# EAGLE design plc_esp32 (EAGLE 9.6.2)
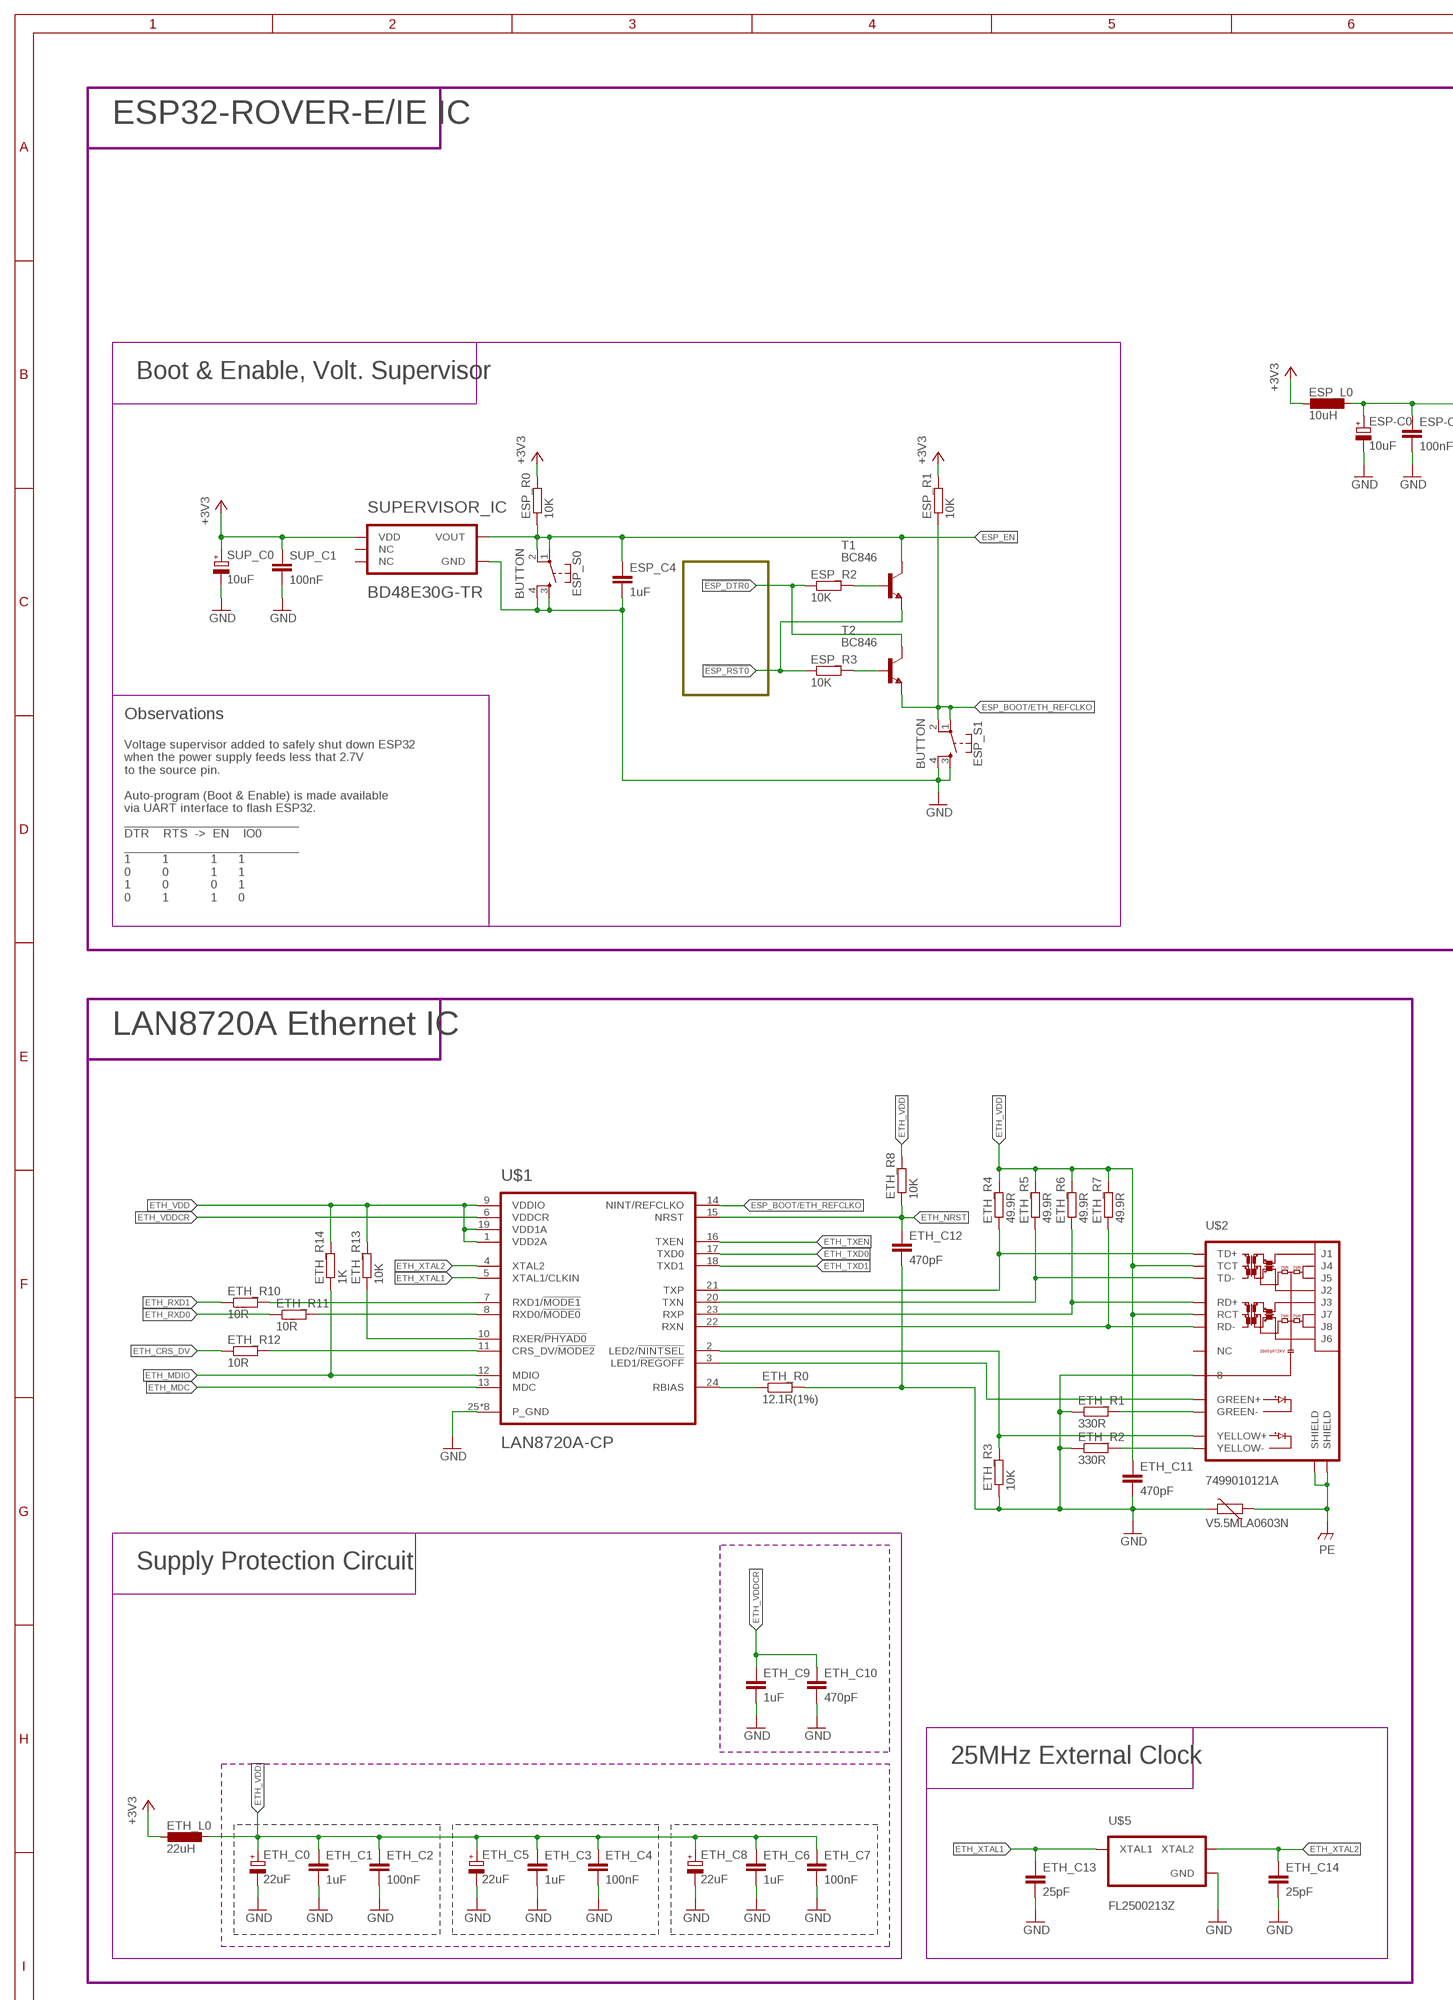
[diagram p0: schematic, sheet 1, part 1 of 2]
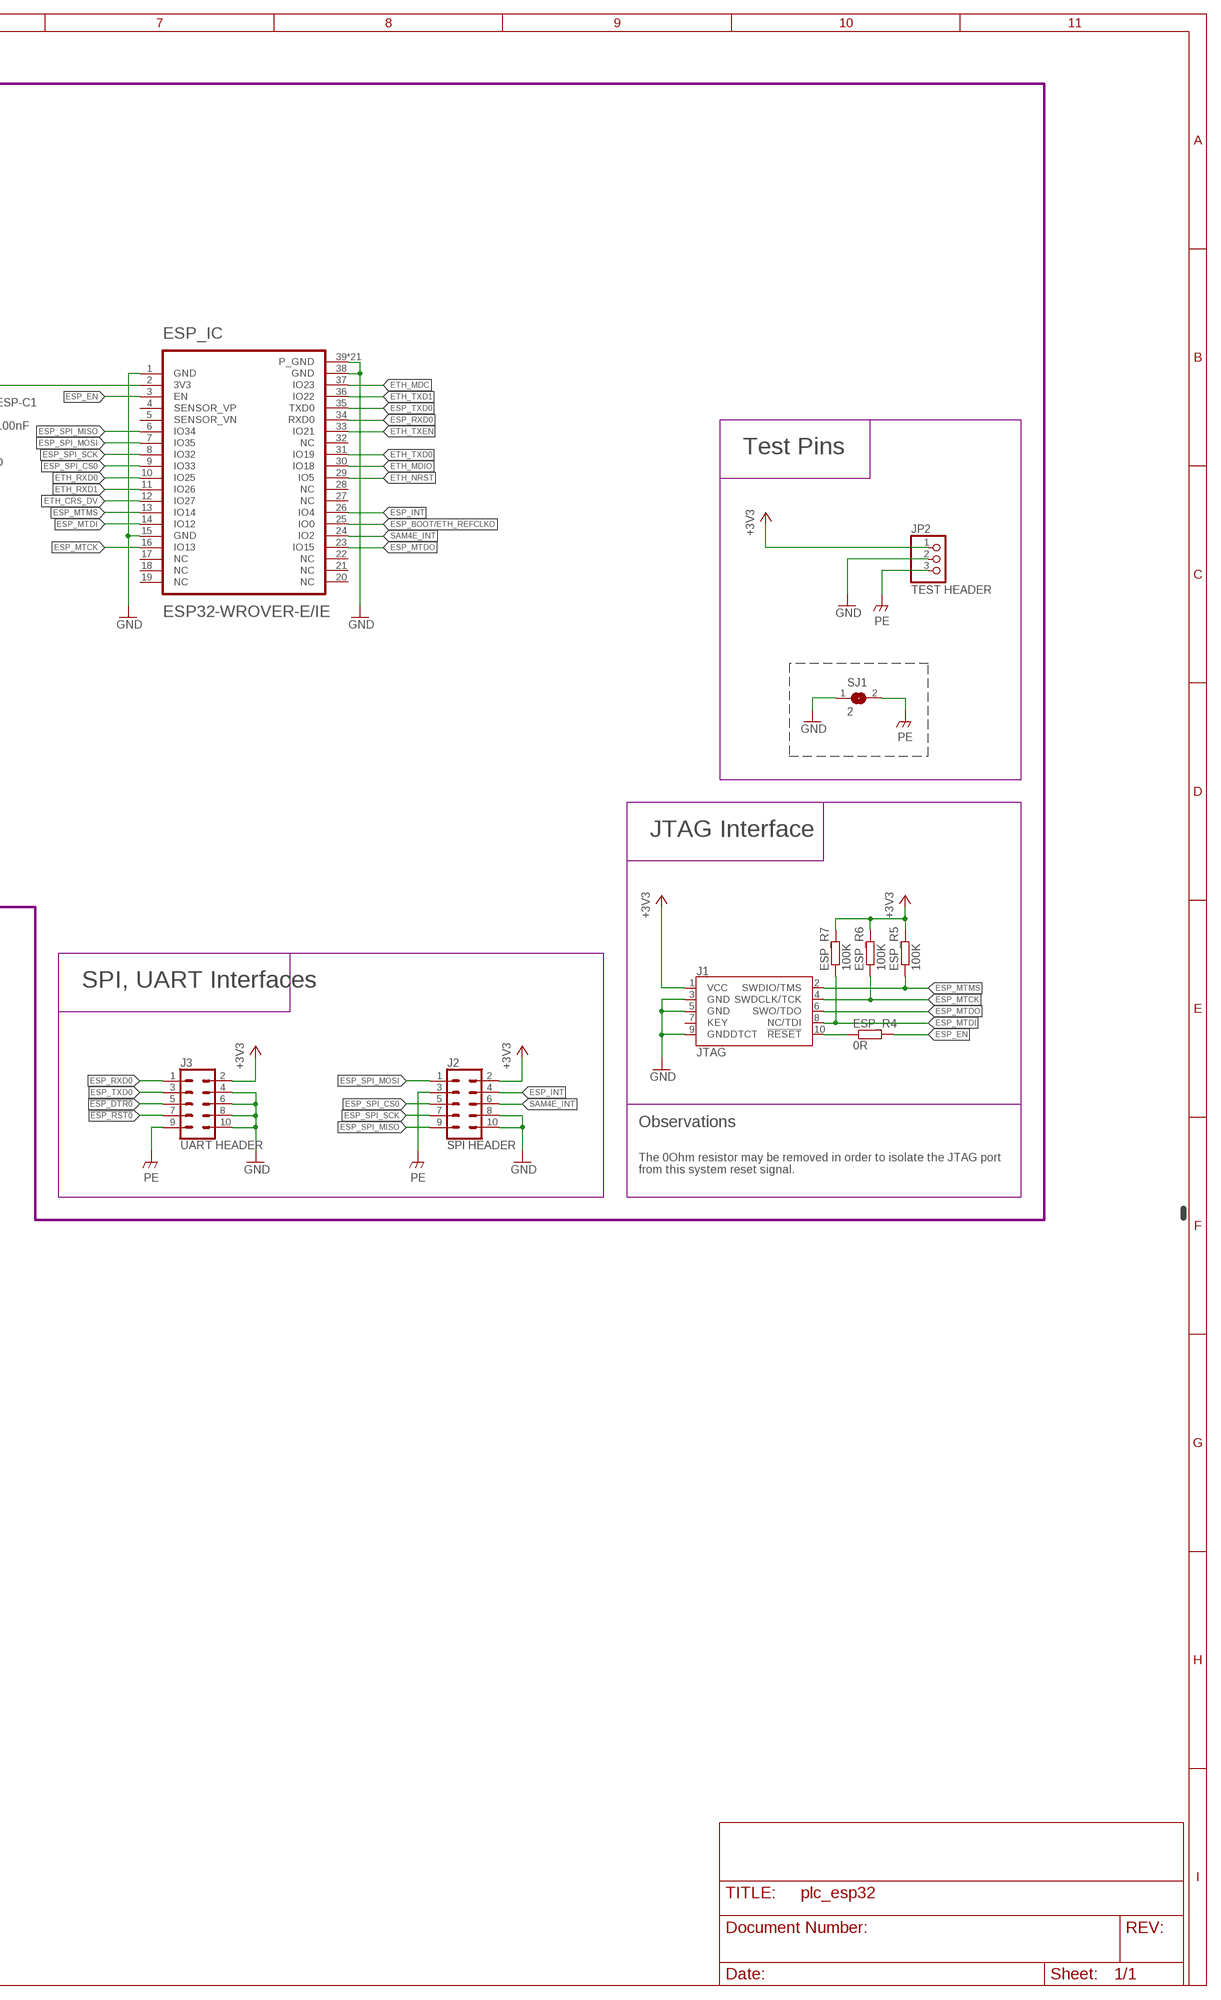
[diagram p1: schematic, sheet 1, part 2 of 2]

## Parts
ESP-C0  10uF  CPOL-EUSMCB  [SMC_B]
ESP-C1  100nF  C-EUC0402  [C0402]
ESP_C4  1uF  C-EUC0402  [C0402]
ESP_IC  ESP32-WROVER-E/IE  [ESP32-WROVER-E/IE]
ESP_L0  10uH  L-EUL1812  [L1812]
ESP_R0  10K  R-EU_R0402  [R0402]
ESP_R1  10K  R-EU_R0402  [R0402]
ESP_R2  10K  R-EU_R0402  [R0402]
ESP_R3  10K  R-EU_R0402  [R0402]
ESP_R4  0R  R-EU_R0402  [R0402]
ESP_R5  100K  R-EU_R0402  [R0402]
ESP_R6  100K  R-EU_R0402  [R0402]
ESP_R7  100K  R-EU_R0402  [R0402]
ESP_S0  BUTTON  MOMENTARY-SWITCH-SPST-2-SMD-4.6X2.8MM  [TACTILE_SWITCH_SMD_4.6X2.8MM]
ESP_S1  BUTTON  MOMENTARY-SWITCH-SPST-2-SMD-4.6X2.8MM  [TACTILE_SWITCH_SMD_4.6X2.8MM]
ETH_C0  22uF  CPOL-EUSMCB  [SMC_B]
ETH_C1  1uF  C-EUC0402  [C0402]
ETH_C2  100nF  C-EUC0402  [C0402]
ETH_C3  1uF  C-EUC0402  [C0402]
ETH_C4  100nF  C-EUC0402  [C0402]
ETH_C5  22uF  CPOL-EUSMCB  [SMC_B]
ETH_C6  1uF  C-EUC0402  [C0402]
ETH_C7  100nF  C-EUC0402  [C0402]
ETH_C8  22uF  CPOL-EUSMCB  [SMC_B]
ETH_C9  1uF  C-EUC0402  [C0402]
ETH_C10  470pF  C-EUC0402  [C0402]
ETH_C11  470pF  C-EUC0402  [C0402]
ETH_C12  470pF  C-EUC0402  [C0402]
ETH_C13  25pF  C-EUC0402  [C0402]
ETH_C14  25pF  C-EUC0402  [C0402]
ETH_L0  22uH  L-EUL1812  [L1812]
ETH_R0  12.1R(1%)  R-EU_R0402  [R0402]
ETH_R1  330R  R-EU_R0402  [R0402]
ETH_R2  330R  R-EU_R0402  [R0402]
ETH_R3  10K  R-EU_R0402  [R0402]
ETH_R4  49.9R  R-EU_R0402  [R0402]
ETH_R5  49.9R  R-EU_R0402  [R0402]
ETH_R6  49.9R  R-EU_R0402  [R0402]
ETH_R7  49.9R  R-EU_R0402  [R0402]
ETH_R8  10K  R-EU_R0402  [R0402]
ETH_R10  10R  R-EU_R0402  [R0402]
ETH_R11  10R  R-EU_R0402  [R0402]
ETH_R12  10R  R-EU_R0402  [R0402]
ETH_R13  10K  R-EU_R0402  [R0402]
ETH_R14  1K  R-EU_R0402  [R0402]
J1  JTAG  CORTEX_JTAG_DEBUG_SMD  [2X5-SMD-1.27MM]
J2  SPI HEADER  CONN_05X2SHD_SMD  [2X5-SHROUDED_SMD]
J3  UART HEADER  CONN_05X2SHD_SMD  [2X5-SHROUDED_SMD]
JP2  TEST HEADER  PINHD-1X3  [1X03]
MCU_VAR1  V5.5MLA0603N  VARISTORCN0603  [CT/CN0603]
SJ1  2  SJ  [SJ]
SUP_C0  10uF  CPOL-EUSMCB  [SMC_B]
SUP_C1  100nF  C-EUC0402  [C0402]
SUPERVISOR_IC  BD48E30G-TR  [SSOP5]
T1  BC846  [SOT23]
T2  BC846  [SOT23]
U$1  LAN8720A-CP  [QFN-24(4X4MM)]
U$2  7499010121A  [RJ45-7499010121A]
U$5  FL2500213Z  [3.2X2.5MM]

## Nets
!ESP_DTR0: ESP_R2.1 J3.5 T2.3(C)
!ESP_RST0: ESP_R3.1 J3.7 T1.2(E)
+3V3: ESP_L0.2 ESP_R0.2 ESP_R1.2 ESP_R5.2 ESP_R6.2 ESP_R7.2 ETH_L0.2 J1.1(VCC) J2.2 J3.2 JP2.1 SUP_C0.+ SUP_C1.1 SUPERVISOR_IC.2(VDD)
ESP_3V3: ESP-C0.+ ESP-C1.1 ESP_IC.2(3V3) ESP_L0.1
ESP_BOOT/ETH_REFCLKO: ESP_IC.25(IO0) ESP_R1.1 ESP_S1.1 ESP_S1.2 T2.2(E) U$1.14(NINT/REFCLKO)
ESP_EN: ESP_C4.1 ESP_IC.3(EN) ESP_R0.1 ESP_R4.2 ESP_S0.1 ESP_S0.2 SUPERVISOR_IC.1(VOUT) T1.3(C)
ESP_INT: ESP_IC.26(IO4) J2.4
ESP_MTCK: ESP_IC.16(IO13) ESP_R6.1 J1.4(SWDCLK/TCK)
ESP_MTDI: ESP_IC.14(IO12) ESP_R7.1 J1.8(NC/TDI)
ESP_MTDO: ESP_IC.23(IO15) J1.6(SWO/TDO)
ESP_MTMS: ESP_IC.13(IO14) ESP_R5.1 J1.2(SWDIO/TMS)
ESP_RXD0: ESP_IC.34(RXD0) J3.1
ESP_SPI_CS0: ESP_IC.9(IO33) J2.5
ESP_SPI_MISO: ESP_IC.6(IO34) J2.9
ESP_SPI_MOSI: ESP_IC.7(IO35) J2.1
ESP_SPI_SCK: ESP_IC.8(IO32) J2.7
ESP_TXD0: ESP_IC.35(TXD0) J3.3
ETH_CRS_DV: ESP_IC.12(IO27) ETH_R12.1
ETH_MDC: ESP_IC.37(IO23) U$1.13(MDC)
ETH_MDIO: ESP_IC.30(IO18) ETH_R14.1 U$1.12(MDIO)
ETH_NRST: ESP_IC.29(IO5) ETH_C12.1 ETH_R8.1 U$1.15(NRST)
ETH_RJ45_LED2: ETH_R3.2 U$1.2(LED2/!NINTSEL) U$2.12(YELLOW+)
ETH_RJ45_RXN: ETH_R7.1 U$1.22(RXN) U$2.6(RD-)
ETH_RJ45_RXP: ETH_R6.1 U$1.23(RXP) U$2.4(RD+)
ETH_RJ45_TXN: ETH_R5.1 U$1.20(TXN) U$2.3(TD-)
ETH_RJ45_TXP: ETH_R4.1 U$1.21(TXP) U$2.1(TD+)
ETH_RXD0: ESP_IC.10(IO25) ETH_R11.1
ETH_RXD1: ESP_IC.11(IO26) ETH_R10.1
ETH_TXD0: ESP_IC.31(IO19) U$1.17(TXD0)
ETH_TXD1: ESP_IC.36(IO22) U$1.18(TXD1)
ETH_TXEN: ESP_IC.33(IO21) U$1.16(TXEN)
ETH_VDD: ETH_C0.+ ETH_C1.1 ETH_C2.1 ETH_C3.1 ETH_C4.1 ETH_C5.+ ETH_C6.1 ETH_C7.1 ETH_C8.+ ETH_C11.1 ETH_L0.1 ETH_R4.2 ETH_R5.2 ETH_R6.2 ETH_R7.2 ETH_R8.2 ETH_R13.2 ETH_R14.2 U$1.1(VDD2A) U$1.9(VDDIO) U$1.19(VDD1A) U$2.2(TCT) U$2.5(RCT)
ETH_VDDCR: ETH_C9.1 ETH_C10.1 U$1.6(VDDCR)
ETH_XTAL1: ETH_C13.1 U$1.5(XTAL1/CLKIN) U$5.1(XTAL1)
ETH_XTAL2: ETH_C14.1 U$1.4(XTAL2) U$5.3(XTAL2)
GND: ESP-C0.- ESP-C1.2 ESP_C4.2 ESP_IC.1(GND) ESP_IC.15(GND) ESP_IC.38(GND) ESP_IC.39(P_GND) ESP_IC.40(P_GND) ESP_IC.41(P_GND) ESP_IC.42(P_GND) ESP_IC.43(P_GND) ESP_IC.44(P_GND) ESP_IC.45(P_GND) ESP_IC.46(P_GND) ESP_IC.47(P_GND) ESP_IC.48(P_GND) ESP_IC.49(P_GND) ESP_IC.50(P_GND) ESP_IC.51(P_GND) ESP_IC.52(P_GND) ESP_IC.53(P_GND) ESP_IC.54(P_GND) ESP_IC.55(P_GND) ESP_IC.56(P_GND) ESP_IC.57(P_GND) ESP_IC.58(P_GND) ESP_IC.59(P_GND) ESP_S0.3 ESP_S0.4 ESP_S1.3 ESP_S1.4 ETH_C0.- ETH_C1.2 ETH_C2.2 ETH_C3.2 ETH_C4.2 ETH_C5.- ETH_C6.2 ETH_C7.2 ETH_C8.- ETH_C9.2 ETH_C10.2 ETH_C11.2 ETH_C12.2 ETH_C13.2 ETH_C14.2 ETH_R0.2 ETH_R1.1 ETH_R2.1 ETH_R3.1 J1.3(GND) J1.5(GND) J1.9(GNDDTCT) J2.8 J2.10 J3.4 J3.6 J3.8 J3.10 JP2.2 MCU_VAR1.2 SJ1.1 SUP_C0.- SUP_C1.2 SUPERVISOR_IC.3(GND) U$1.25(P_GND) U$1.26(P_GND) U$1.27(P_GND) U$1.28(P_GND) U$1.29(P_GND) U$1.30(P_GND) U$1.31(P_GND) U$1.32(P_GND) U$2.8 U$5.2(GND) U$5.4(GND)
N$1: ETH_R0.1 U$1.24(RBIAS)
N$2: ETH_R10.2 U$1.7(RXD1/!MODE1)
N$3: ETH_R11.2 U$1.8(RXD0/!MODE0)
N$4: ETH_R13.1 U$1.10(RXER/!PHYAD0)
N$5: ESP_R4.1 J1.10(!RESET)
N$6: U$1.3(LED1/!REGOFF) U$2.10(GREEN+)
N$7: ESP_R3.2 T2.1(B)
N$8: ESP_R2.2 T1.1(B)
N$10: ETH_R12.2 U$1.11(CRS_DV/!MODE2)
N$17: ETH_R1.2 U$2.9(GREEN-)
N$19: ETH_R2.2 U$2.11(YELLOW-)
P$1: J2.3 J3.9 JP2.3 MCU_VAR1.1 SJ1.2 U$2.13(SHIELD) U$2.14(SHIELD) ; supply symbol labelled PE
SAM4E_INT: ESP_IC.24(IO2) J2.6
Unconnected: ESP_IC.4(SENSOR_VP) ESP_IC.5(SENSOR_VN) ESP_IC.17(NC) ESP_IC.18(NC) ESP_IC.19(NC) ESP_IC.20(NC) ESP_IC.21(NC) ESP_IC.22(NC) ESP_IC.27(NC) ESP_IC.28(NC) ESP_IC.32(NC) J1.7(KEY) SUPERVISOR_IC.4(NC) SUPERVISOR_IC.5(NC) U$2.7(NC)

## Notes on the sheet
- ESP32-ROVER-E/IE IC
- Boot & Enable, Volt. Supervisor
- Test Pins
- Observations
- JTAG Interface
- Voltage supervisor added to safely shut down ESP32
  when the power supply feeds less that 2.7V
  to the source pin.
  
  Auto-program (Boot & Enable) is made available
  via UART interface to flash ESP32.
  _________________________
  DTR    RTS  ->  EN    IO0
  _________________________
  1         1            1      1
  0         0            1      1
  1         0            0      1
  0         1            1      0
- LAN8720A Ethernet IC | SPI, UART Interfaces
- Observations
- The 0Ohm resistor may be removed in order to isolate the JTAG port
  from this system reset signal.
- Supply Protection Circuit
- 25MHz External Clock

## Library data of the parts
ESP-C0 ETH_C0 ETH_C5 ETH_C8 SUP_C0 = rcl:CPOL-EU: POLARIZED CAPACITOR, European symbol; SPICEPREFIX: C
ESP-C1 ESP_C4 ETH_C1-ETH_C4 ETH_C6 ETH_C7 ETH_C9-ETH_C14 SUP_C1 = rcl:C-EU: CAPACITOR, European symbol; SPICEPREFIX: C
ESP_IC = my-EspressifSystems:ESP32-WROVER-E/IE: WiFi Modules - 802.11 SMD Module ESP32-WROVER-E, ESP32-D0WD-V3, 3.3V 64Mbit PSRAM, 8/16 MB SPI flash, PCB Antenna
ESP_L0 ETH_L0 = rcl:L-EU: INDUCTOR, European symbol; SPICEPREFIX: L
ESP_R0 ESP_R1-ESP_R7 ETH_R0 ETH_R1-ETH_R8 ETH_R10-ETH_R14 = rcl:R-EU_: RESISTOR, European symbol; SPICEPREFIX: R
ESP_S0 ESP_S1 = SparkFun-Switches:MOMENTARY-SWITCH-SPST-2: Momentary Switch (Pushbutton) - SPST - Two Circuits Normally-open (NO) SPST momentary switches (buttons, pushbuttons). Schematic symbol includes two switch circuits. Variants SMD-4.6MMX2.8MM - 4.60mm x 2.80mm Tactile Momentary Button Switch - Used on SparkFun Pro Micro - RP2040 <https://www.sparkfun.com/products/17717> SMD-5.2MM - Mini Pushbutton Switch - SMD <https://www.sparkfun.com/products/8720> - Used on Arduino Pro Mini <https://www.sparkfun.com/products/11114>; PROD_ID: SWCH-15606
J1 = SparkFun-Connectors:CORTEX_JTAG_DEBUG: Cortex Debug Connector - 10 pin Supports JTAG debug, Serial Wire debug, and Serial Wire Viewer. PTH and SMD connector options available. General Connector Information <http://infocenter.arm.com/help/topic/com.arm.doc.faqs/attached/13634/cortex_debug_connectors.pdf> Products: PTH Connector <http://www.digikey.com/product-detail/en/cnc-tech/3220-10-0100-00/1175-1627-ND/3883661> -via Digi-Key SparkFun PSoc <https://www.sparkfun.com/products/13229> SparkFun T <https://www.sparkfun.com/products/13810>; PROD_ID: CONN-14503
J2 J3 = SparkFun-Connectors:CONN_05X2: Multi connection point. Often used as Generic Header-pin footprint for 0.1 inch spaced/style header connections For AVR SPI programming port, see special device with nice symbol: "AVR_SPI_PROG_5x2.dev" You can populate with any combo of single row headers, but if you'd like an exact match, check these: 2x5 AVR ICSP Male Header <https://www.sparkfun.com/products/778> (PRT-00778) 2x5 Pin Shrouded Header <https://www.sparkfun.com/products/8506> (PRT-08506) On any of the 0.1 inch spaced packages, you can populate with these: Break Away Headers - Straight <https://www.sparkfun.com/products/116> (PRT-00116) Break Away Male Headers - Right Angle <https://www.sparkfun.com/products/553> (PRT-00553) Female Headers <https://www.sparkfun.com/products/115> (PRT-00115) Break Away Headers - Machine Pin <https://www.sparkfun.com/products/117> (PRT-00117) Break Away Female Headers - Swiss Machine Pin <https://www.sparkfun.com/products/743> (PRT-00743) Special note: the shrouded connector mates well with our 5x2 ribbon cables: 2x5 Pin IDC Ribbon Cable <https://www.sparkfun.com/products/8535> (PRT-08535); PROD_ID: CONN-09508
JP2 = pinhead:PINHD-1X3: PIN HEADER
MCU_VAR1 = varistor:VARISTOR: VARISTOR
SJ1 = jumper:SJ: SMD solder JUMPER
SUPERVISOR_IC = my-ROHMSemiconductor:BD48E30G-TR: Supervisory Circuits VOLTAGE DETECTOR. Vref = 3.0V
T1 T2 = transistor:BC846: NPN TRANSISTOR
U$1 = my-MicrochipTechnology:LAN8720A-CP: Ethernet ICs RMII 10/100 ETH XCVR w/HP AutoMDIXSupport
U$2 = my-WurthElektronik:7499010121A: LAN-Transformer WE-RJ45LAN 10/100BaseT
U$5 = my-DiodesIncorporated:FL2500213Z: Crystals 25.000MHz 20pF 20ppm -40 to +85

## Board
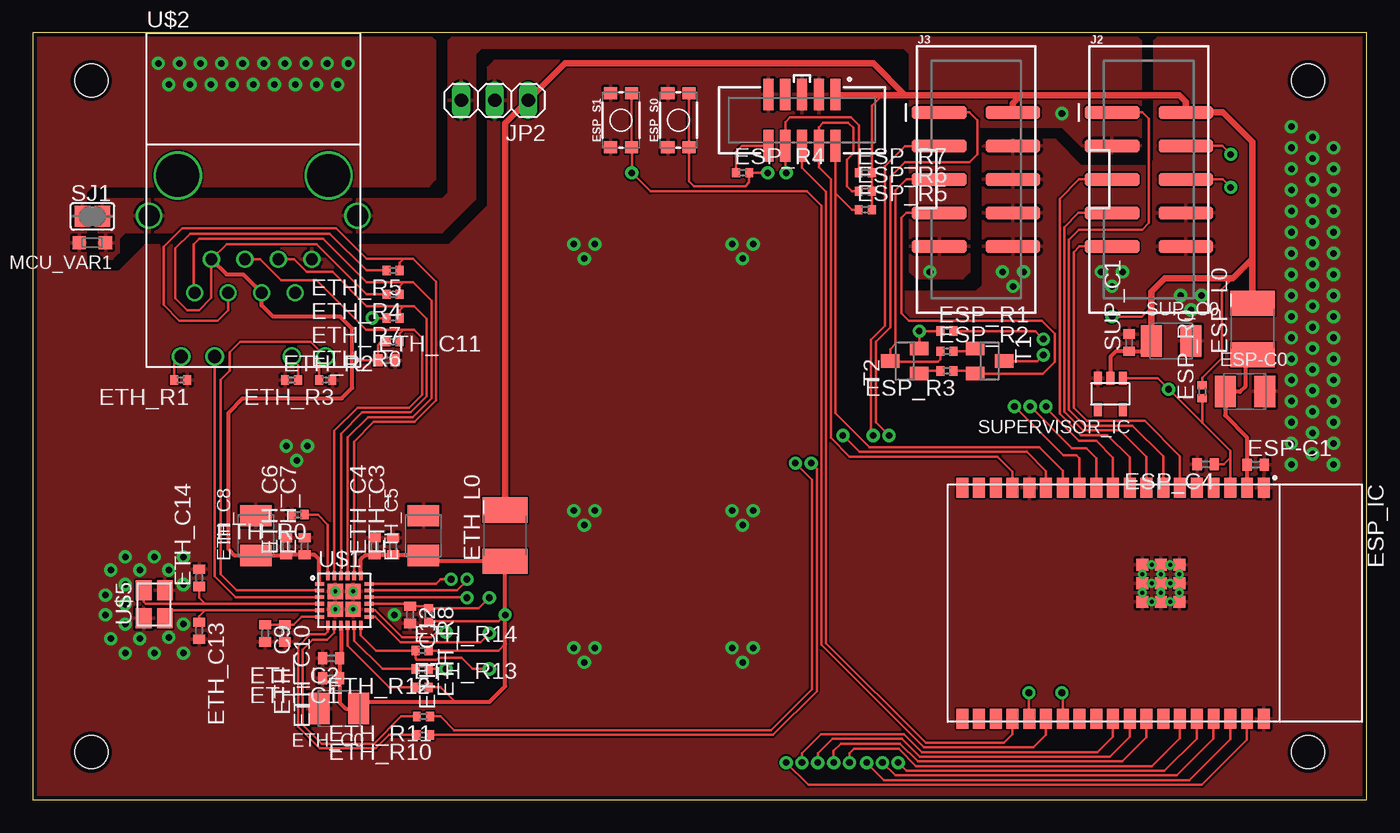
[diagram p2: board, top side]
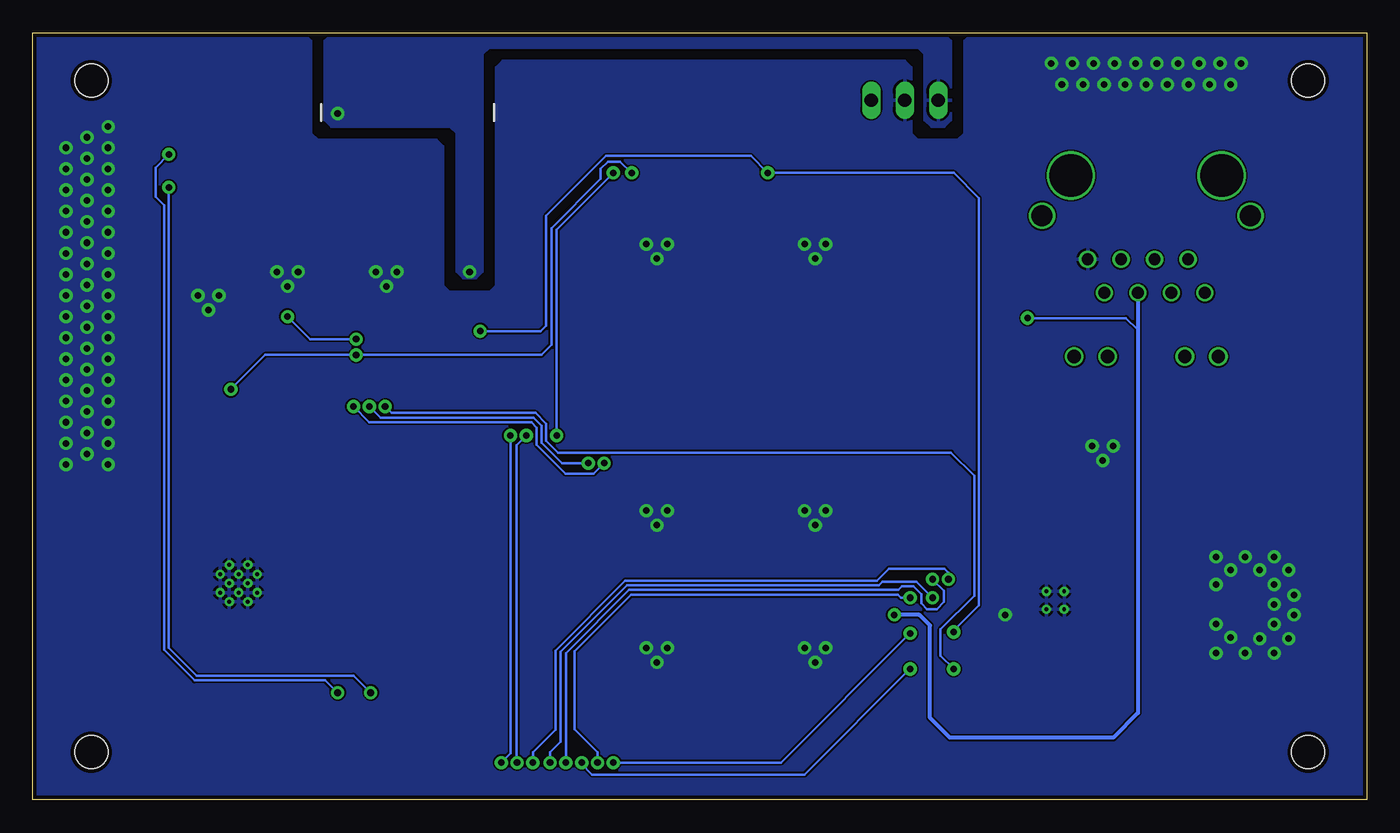
[diagram p3: board, bottom side, seen from below]

Size 101.1 x 58.1 mm. Coordinates in mm from the lower left corner, seen from the top.
Outline: 0,0 101.1,0 101.1,58.1 0,58.1 0,0
Copper layers (1*16): Top 0.035mm / dielectric 1.5mm / Bottom 0.035mm
Design rules "PCB-POOL HighSpec": minimum track width 0.125mm, minimum drill 0.2mm, track to track 0.125mm, track to pad 0.125mm, pad to pad 0.125mm, via to via 0.125mm, smd to smd 0.125mm, copper to edge 0.3mm, drill to drill 0.2mm, minimum pad ring 0.2mm, minimum via ring 0.125mm, stop-mask expansion 0.03mm, vias tented up to drill 0mil, thermal gap 0.2mm
Holes 2.5 mm at 96.67,54.5 4.42,3.6 96.67,3.6 4.42,54.5

### Footprints (pad centres in the part's own frame; a part is rotated, then mirrored left to right if it is on the bottom)
SMC_B = smd 1.6 x 2.4: + -1.5,0; - 1.5,0
C0402 = smd 0.7 x 0.9: 1 -0.65,0; 2 0.65,0
ESP32-WROVER-E/IE = smd 1.5 x 0.9: 1 0.25,-7.44; 2 0.25,-8.71; 3 0.25,-9.98; 4 0.25,-11.25; 5 0.25,-12.52; 6 0.25,-13.79; 7 0.25,-15.06; 8 0.25,-16.33; 9 0.25,-17.6; 10 0.25,-18.87; 11 0.25,-20.14; 12 0.25,-21.41; 13 0.25,-22.68; 14 0.25,-23.95; 15 0.25,-25.22; 16 0.25,-26.49; 17 0.25,-27.76; 18 0.25,-29.03; 19 0.25,-30.3; 20 17.75,-30.3; 21 17.75,-29.03; 22 17.75,-27.76; 23 17.75,-26.49; 24 17.75,-25.22; 25 17.75,-23.95; 26 17.75,-22.68; 27 17.75,-21.41; 28 17.75,-20.14; 29 17.75,-18.87; 30 17.75,-17.6; 31 17.75,-16.33; 32 17.75,-15.06; 33 17.75,-13.79; 34 17.75,-12.52; 35 17.75,-11.25; 36 17.75,-9.98; 37 17.75,-8.71; 38 17.75,-7.44 | smd 0.9 x 0.9: 39 6.1,-13.84; 40 7.5,-13.84; 41 8.9,-13.84; 42 6.1,-15.24; 43 7.5,-15.24; 44 8.9,-15.24; 45 6.1,-16.64; 46 7.5,-16.64; 47 8.9,-16.64 | drill 0.3: 48 6.8,-13.84; 49 8.2,-13.84; 50 6.1,-14.54; 51 7.5,-14.54; 52 8.9,-14.54; 53 6.8,-15.24; 54 8.2,-15.24; 55 6.09,-15.94; 56 7.5,-15.94; 57 8.9,-15.94; 58 6.8,-16.64; 59 8.2,-16.64
L1812 = smd 1.9 x 3.4: 1 -1.95,0; 2 1.95,0
R0402 = smd 0.6 x 0.7: 1 -0.5,0; 2 0.5,0
TACTILE_SWITCH_SMD_4.6X2.8MM = smd 0.9 x 1: 1 -2.05,-0.8; 2 2.05,-0.8; 3 2.05,0.8; 4 -2.05,0.8
2X5-SMD-1.27MM = smd 0.76 x 2.4: 1 2.54,1.95; 2 2.54,-1.95; 3 1.27,1.95; 4 1.27,-1.95; 5 0,1.95; 6 0,-1.95; 7 -1.27,1.95; 8 -1.27,-1.95; 9 -2.54,1.95; 10 -2.54,-1.95
2X5-SHROUDED_SMD = smd 4.15 x 1: 1 -2.794,5.08; 2 2.794,5.08; 3 -2.794,2.54; 4 2.794,2.54; 5 -2.794,0; 6 2.794,0; 7 -2.794,-2.54; 8 2.794,-2.54; 9 -2.794,-5.08; 10 2.794,-5.08
1X03 = drill 1.016 long: 1 -2.54,0; 2 0,0; 3 2.54,0
CT/CN0603 = smd 1 x 1: 1 -1,0; 2 1,0
SJ = smd 1.168 x 1.6: 1 -0.762,0; 2 0.762,0
SSOP5 = smd 0.6 x 1: 1 -0.95,-1.2; 2 0,-1.2; 3 0.95,-1.2; 4 0.95,1.2; 5 -0.95,1.2
SOT23 = smd 1 x 1.4: 1 -0.95,-1.1; 2 0.95,-1.1; 3 0,1.1
QFN-24(4X4MM) = smd 0.69 x 0.28: 1 -1.875,1.25; 2 -1.875,0.75; 3 -1.875,0.25; 4 -1.875,-0.25; 5 -1.875,-0.75; 6 -1.875,-1.25; 13 1.875,-1.25; 14 1.875,-0.75; 15 1.875,-0.25; 16 1.875,0.25; 17 1.875,0.75; 18 1.875,1.25 | smd 0.28 x 0.69: 7 -1.25,-1.875; 8 -0.75,-1.875; 9 -0.25,-1.9; 10 0.25,-1.875; 11 0.75,-1.875; 12 1.25,-1.875; 19 1.25,1.875; 20 0.75,1.875; 21 0.25,1.875; 22 -0.25,1.875; 23 -0.75,1.875; 24 -1.25,1.875 | smd 1.15 x 1.15: 25 -0.675,0.675; 26 0.675,0.675; 27 -0.675,-0.675; 28 0.675,-0.675 | drill 0.3: 29 -0.675,0.675; 30 0.675,0.675; 31 -0.675,-0.675; 32 0.675,-0.675
RJ45-7499010121A = drill 0.9: 1 -4.445,-8.89; 2 -3.175,-6.35; 3 -1.905,-8.89; 4 -0.635,-6.35; 5 0.635,-8.89; 6 1.905,-6.35; 7 3.175,-8.89; 8 4.445,-6.35 | drill 1.02: 9 -5.465,-13.72; 10 -2.925,-13.72; 11 2.925,-13.72; 12 5.465,-13.72 | drill 1.6: 13 -7.9,-3.05; 14 7.9,-3.05 | drill 3.25: M1 -5.715,0; M2 5.715,0
3.2X2.5MM = smd 1.5 x 1.2: 1 -1.06,-0.8; 2 1.06,-0.8; 3 1.06,0.8; 4 -1.06,0.8

### Placement (x,y rotation side)
ESP-C0  91.88,30.93 0 top
ESP-C1  92.69,25.39 0 top
ESP_C4  88.91,25.41 180 top
ESP_IC  100.75,23.89 270 top
ESP_L0  92.46,35.68 90 top
ESP_R0  88.64,30.91 90 top
ESP_R1  69.28,35.51 0 top
ESP_R2  69.28,33.99 0 top
ESP_R3  69.29,32.49 180 top
ESP_R4  53.8,47.5 0 top
ESP_R5  63.1,44.7 0 top
ESP_R6  63.1,46.1 0 top
ESP_R7  63.1,47.5 0 top
ESP_S0  48.93,51.49 90 top
ESP_S1  44.58,51.49 90 top
ETH_C0  23.2,6.9 180 top
ETH_C1  22.6,9.2 180 top
ETH_C2  22.6,10.7 180 top
ETH_C3  27.3,19.2 90 top
ETH_C4  25.9,19.2 90 top
ETH_C5  29.6,20 90 top
ETH_C6  19.2,19.2 90 top
ETH_C7  20.6,19.2 90 top
ETH_C8  16.9,20 90 top
ETH_C9  17.6,12.6 270 top
ETH_C10  19.1,12.6 270 top
ETH_C11  26.8,33.3 0 top
ETH_C12  28.6,14 270 top
ETH_C13  12.6,12.8 270 top
ETH_C14  12.6,16.8 90 top
ETH_L0  35.8,20 90 top
ETH_R0  20.1,21.6 180 top
ETH_R1  11.2,31.8 180 top
ETH_R2  19.6,31.8 0 top
ETH_R3  22.2,31.8 180 top
ETH_R4  27.3,38.3 180 top
ETH_R5  27.3,40.1 180 top
ETH_R6  27.3,34.7 180 top
ETH_R7  27.3,36.5 180 top
ETH_R8  30,14 270 top
ETH_R10  29.6,4.9 180 top
ETH_R11  29.6,6.3 180 top
ETH_R12  29.5,9.9 180 top
ETH_R13  29.5,8.5 0 top
ETH_R14  29.5,11.3 0 top
J1  58.3,51.5 0 top
J2  84.6,47 0 top
J3  71.5,47 0 top
JP2  35,53 180 top
MCU_VAR1  4.5,42.2 180 top
SJ1  4.5,44.2 0 top
SUP_C0  86.28,34.76 0 top
SUP_C1  83.1,34.63 90 top
SUPERVISOR_IC  81.68,30.74 180 top
T1  72.52,33.24 270 top
T2  66.1,33.24 90 top
U$1  23.6,15.1 0 top
U$2  16.7,47.3 0 top
U$5  9.2,14.8 90 top

### Tracks (layer width: path | path; a pad name or v marks a point on that pad's centre or on a via)
!ESP_DTR0
  Top 0.203: ESP_R2.1 68.78,33.38 68.6,33.2 65.04,33.2 T2.3 65,34.14 65.4,34.54 65.4,46.2 66.2,47 J3.5
!ESP_RST0
  Top 0.203: ESP_R3.1 71.22,32.49 T1.2 76.57,32.29 77.48,33.2 77.48,35.3 76.48,36.3 66.4,36.3 65.86,36.84 65.86,44.1 66.22,44.46 J3.7
+3V3  (via drill 0.5 pad 1)
  Top 0.203: ESP_R5.2 ESP_R6.2 ESP_R7.2 63.6,52.6 64.4,53.4 | 84.78,37.3 84.08,36.6 v81.8,36.6 | ESP_R1.2 75.99,35.51 v76.6,34.9 | ESP_R0.2 88.64,31.96 90.13,33.46 90.13,38.67 90.96,39.5
  Top 0.305: SUP_C0.+ 84.78,34.16 84.6,33.98 SUP_C1.1 82.08,33.98 81.68,33.58 SUPERVISOR_IC.2
  Top 0.508: J3.2 74.29,52.79 74.9,53.4 | 74.9,53.4 86.9,53.4 87.39,52.91 J2.2 90.22,52.08 92.46,49.84 92.46,41 | J1.1 60.89,53.4 64.4,53.4 66.1,53.4 | 74.9,53.4 66.1,53.4 | ESP_L0.2 92.46,41 | 92.46,41 90.96,39.5 85.8,39.5 84.78,38.48 84.78,37.3 SUP_C0.+ | 66.1,53.4 63.7,55.8 40.34,55.8 JP2.1 35.8,51.26 ETH_L0.2
  Bottom 0.203: v81.8,36.6 80.1,34.9 v76.6,34.9
ESP_3V3
  Top 0.305: ESP_L0.1 91.9,33.17 91.9,31.3 91.5,30.9 90.41,30.9 ESP-C0.+ 90.38,29.12 92.04,27.46 ESP-C1.1 ESP_IC.2
ESP_BOOT/ETH_REFCLKO  (via drill 0.5 pad 1)
  Top 0.203: U$1.14 25.95,14.35 28,12.3 30.2,12.3 30.6,12.7 v31.3,12.7 | ESP_IC.25 76.8,4.9 75.86,3.96 67.53,3.96 59.77,11.72 59.77,45 58.67,46.1 46.8,46.1 v45.4,47.5 45.4,49.42 ESP_S1.1 ESP_S1.2 | ESP_R1.1 v67.21,35.51 v67.2,35.5 T2.2
  Bottom 0.203: v31.3,12.7 31.3,12.83 29.39,14.74 29.39,45.59 31.3,47.5 v45.4,47.5 46.68,48.78 57.65,48.78 62.18,44.25 62.18,35.92 62.6,35.5 v67.2,35.5
ESP_EN  (via drill 0.5 pad 1)
  Top 0.203: ESP_IC.3 90.77,25.9 | 90.77,25.9 90.77,26.43 88.64,28.56 | 90.77,25.9 90.28,25.41 ESP_C4.1 | ESP_R0.1 88.64,28.56 | 88.64,28.56 v86.1,31.1 85.26,31.94 SUPERVISOR_IC.1 | T1.3 76.14,33.24 v76.6,33.7 | ESP_S0.2 ESP_S0.1 49.73,46.87 50.1,46.5 54,46.5 54.3,46.8 ESP_R4.2 v55.7,47.5
  Bottom 0.203: v86.1,31.1 83.5,33.7 v76.6,33.7 62.56,33.7 61.8,34.46 61.8,43.3 58.05,47.05 58.05,47.81 57.51,48.35 56.59,48.35 55.73,47.5 v55.7,47.5
ESP_INT  (via drill 0.5 pad 1)
  Top 0.203: ESP_IC.26 78.07,8.03 v78,8.1 | J2.4 90.16,49.54 v90.8,48.9
  Bottom 0.203: v78,8.1 78.94,9.04 88.85,9.04 91.16,11.35 91.16,45.06 91.8,45.7 91.8,47.9 v90.8,48.9
ESP_MTCK
  Top 0.203: ESP_IC.16 74.26,24.84 73.1,26 61.91,26 60.48,27.42 60.48,47.02 59.57,47.93 J1.4 59.57,50.97 59.9,51.3 61.8,51.3 62.2,50.9 62.2,49 61.7,48.5 61.7,46.5 62.1,46.1 ESP_R6.1
ESP_MTDI  (via drill 0.5 pad 1)
  Top 0.203: ESP_IC.14 76.8,24.9 75.34,26.36 62.64,26.36 v61.4,27.6 | v57.1,47.5 57.03,47.57 J1.8 57.03,51.33 57.4,51.7 62,51.7 62.6,51.1 ESP_R7.1
  Bottom 0.203: v57.1,47.5 61.4,43.2 v61.4,27.6
ESP_MTDO
  Top 0.203: ESP_IC.23 74.26,4.96 73.62,4.32 67.68,4.32 60.13,11.87 60.13,46.07 58.3,47.9 J1.6
ESP_MTMS
  Top 0.203: ESP_IC.13 78.07,24.93 76.29,26.71 63.4,26.71 60.84,29.27 60.84,45.96 | J1.2 60.84,46 60.84,45.96 | ESP_R5.1 62.1,44.7 60.84,45.96
ESP_RXD0  (via drill 0.5 pad 1)
  Top 0.203: ESP_IC.34 88.23,4.63 85.78,2.18 66.22,2.18 v65.6,2.8 | v64.9,27.6 63.9,28.6 63.9,34.7 65,35.8 65,47.2 66.1,48.3 71,48.3 71.6,48.9 71.6,51.5 71,52.1 68.73,52.1 J3.1
  Bottom 0.203: v64.9,27.6 64.9,3.5 v65.6,2.8
ESP_SPI_CS0
  Top 0.203: ESP_IC.9 83.15,25.95 81.47,27.63 79.46,27.63 77.83,29.26 77.83,45.53 79.3,47 J2.5
ESP_SPI_MISO
  Top 0.203: ESP_IC.6 86.96,26.04 84.3,28.7 79.9,28.7 78.9,29.7 78.9,41.5 79.32,41.92 J2.9
ESP_SPI_MOSI
  Top 0.203: J2.1 84.12,52.08 84.6,51.6 84.6,43.7 84.1,43.2 79.3,43.2 78.54,42.44 78.54,29.55 79.75,28.34 83.36,28.34 85.69,26.01 ESP_IC.7
ESP_SPI_SCK
  Top 0.203: ESP_IC.8 84.42,25.98 82.41,27.99 79.61,27.99 78.19,29.41 78.19,43.39 79.26,44.46 J2.7
ESP_TXD0  (via drill 0.5 pad 1)
  Top 0.203: ESP_IC.35 89.5,4.6 86.73,1.83 65.37,1.83 v64.4,2.8 | v63.7,27.6 63.7,27.7 63.54,27.86 63.54,34.85 64.6,35.9 64.6,48 66.1,49.5 68.67,49.5 J3.3
  Bottom 0.203: v63.7,27.6 64.44,26.86 64.44,2.84 v64.4,2.8
ETH_CRS_DV  (via drill 0.5 pad 1)
  Top 0.203: ETH_R12.1 v31.3,9.9 | ESP_IC.12 79.34,25.86 79.11,26.09 78.11,26.09 v74.4,29.8
  Bottom 0.203: v31.3,9.9 32.3,10.9 32.3,12.9 29.75,15.45 29.75,24.55 31.5,26.3 61.3,26.3 62.2,27.2 62.2,28.5 63.02,29.31 73.91,29.31 v74.4,29.8
ETH_MDC  (via drill 0.5 pad 1)
  Top 0.203: U$1.13 25.95,13.85 27.85,11.94 33.94,11.94 v34.6,12.6 | ESP_IC.37 92.04,4.54 88.62,1.12 58.78,1.12 v57.1,2.8
  Bottom 0.203: v34.6,12.6 44.4,2.8 v57.1,2.8
ETH_MDIO  (via drill 0.5 pad 1)
  Top 0.203: U$1.12 24.85,12.45 26.01,11.29 28.99,11.29 ETH_R14.1 29,10.7 29.1,10.6 30.6,10.6 30.74,10.74 32.5,10.74 33.34,9.9 v34.6,9.9 | ESP_IC.30 83.15,4.75 81.65,3.25 67.24,3.25 65.89,4.6 60.59,4.6 59.5,3.51 v59.5,2.8
  Bottom 0.203: v34.6,9.9 42.6,1.9 58.7,1.9 59.5,2.7 v59.5,2.8
ETH_NRST  (via drill 0.5 pad 1)
  Top 0.203: ESP_IC.29 81.88,4.78 80.71,3.61 67.39,3.61 66.04,4.95 59.74,4.95 58.3,3.51 v58.3,2.8 | v34.6,15.3 33.8,14.5 ETH_R8.1 29.85,14.65 ETH_C12.1 28.4,14.85 U$1.15
  Bottom 0.203: v58.3,2.8 58.3,3.6 60.03,5.33 60.03,11.26 55.76,15.53 35.53,15.53 35.3,15.3 v34.6,15.3
ETH_RJ45_LED2
  Top 0.203: ETH_R3.2 21.7,32.91 22.16,33.38 U$2.12 21.05,34.7 15.7,34.7 14.9,33.9 14.9,32.5 14.21,31.81 14.21,17.09 15.45,15.85 U$1.2
ETH_RJ45_RXN
  Top 0.203: 28.1,37.4 28.9,37.4 29.86,36.44 29.86,30.55 28.65,29.34 24.95,29.34 23.34,27.74 U$1.22 | 28.1,37.4 25.3,37.4 22.71,39.99 20.75,39.99 19.79,40.95 U$2.6 | ETH_R7.1 27.8,37.1 28.1,37.4
ETH_RJ45_RXP
  Top 0.203: 28.1,35.6 28.9,35.6 29.5,35 29.5,30.7 28.5,29.7 24.6,29.7 22.84,27.94 U$1.23 | ETH_R6.1 27.8,35.3 28.1,35.6 | U$2.4 17.23,40.95 18.81,39.37 21.51,39.37 25.27,35.6 28.1,35.6
ETH_RJ45_TXN
  Top 0.203: 28.1,41 28.8,41 30.57,39.23 30.57,30.26 28.94,28.63 25.84,28.63 24.34,27.14 24.35,27.13 U$1.20 | ETH_R5.1 27.8,40.7 28.1,41 | 28.1,41 25.3,41 23,43.3 11.3,43.3 9.9,41.9 9.9,37.5 11.1,36.3 14,36.3 14.8,37.1 U$2.3
ETH_RJ45_TXP
  Top 0.203: 28.1,39.2 28.8,39.2 30.21,37.79 30.21,30.41 28.8,28.99 25.39,28.99 23.85,27.44 U$1.21 | 28.1,39.2 25.3,39.2 22,42.5 12.6,42.5 12.2,42.1 12.2,38.47 U$2.1 | ETH_R4.1 27.8,38.9 28.1,39.2
ETH_RXD0  (via drill 0.5 pad 1)
  Top 0.203: ETH_R11.1 30.9,6.3 31.94,5.26 55.95,5.26 59.06,8.37 59.06,24.24 v57.8,25.5 | ESP_IC.10 81.88,25.92 80.6,27.2 79.3,27.2 76.8,29.7 v76.8,29.8
  Bottom 0.203: v57.8,25.5 58.6,24.7 60.71,24.7 62.91,26.91 62.91,28.2 63.31,28.6 75.6,28.6 v76.8,29.8
ETH_RXD1  (via drill 0.5 pad 1)
  Top 0.203: ETH_R10.1 56.1,4.9 59.42,8.22 59.42,25.08 v59,25.5 | ESP_IC.11 80.61,25.89 79.86,26.64 78.76,26.64 v75.6,29.8
  Bottom 0.203: v59,25.5 61,25.5 62.56,27.05 62.56,28.35 63.16,28.96 74.76,28.96 v75.6,29.8
ETH_TXD0  (via drill 0.5 pad 1)
  Top 0.203: ESP_IC.31 84.42,4.72 82.6,2.9 67.09,2.9 65.74,4.24 61.24,4.24 60.7,3.7 v60.7,2.8 | v32.9,16.7 32.9,16.6 32.15,15.85 U$1.17
  Bottom 0.203: v60.7,2.8 60.7,11.09 55.91,15.89 35.48,15.89 35.21,16.15 34.35,16.15 33.75,15.55 33.75,14.89 33.31,14.45 32.59,14.45 32.05,14.99 32.05,15.81 32.9,16.67 v32.9,16.7
ETH_TXD1  (via drill 0.5 pad 1)
  Top 0.203: ESP_IC.36 90.77,4.57 87.67,1.47 64.53,1.47 v63.2,2.8 | v31.7,16.7 30.9,16.7 30.55,16.35 U$1.18
  Bottom 0.203: v63.2,2.8 63.2,3.6 61.5,5.3 61.5,11.3 56.2,16.6 37.1,16.6 36.2,17.5 32,17.5 31.7,17.2 v31.7,16.7
ETH_TXEN  (via drill 0.5 pad 1)
  Top 0.203: ESP_IC.33 86.96,4.66 84.84,2.54 66.94,2.54 65.64,3.84 62.24,3.84 61.9,3.5 v61.9,2.8 | v32.9,15.3 32.85,15.35 U$1.16
  Bottom 0.203: v61.9,2.8 61.9,3.6 61.1,4.4 61.1,11.2 56.05,16.24 36.95,16.24 36.69,16.51 34.11,16.51 v32.9,15.3
ETH_VDD  (via drill 0.5 pad 1)
  Top 0.152: 23.35,10.8 ETH_C2.1
  Top 0.203: 35.8,11.8 35.3,11.3 ETH_R14.2 | v35.8,14 35.3,13.5 ETH_R8.2 | 32,7.4 30.9,8.5 ETH_R13.2 | ETH_R7.2 v25.7,36.5 | ETH_R5.2 25.3,40.1 22.5,42.9 11.9,42.9 10.8,41.8 10.8,38 11.7,37.1 12.6,37.1 13.53,38.02 U$2.2 14.68,42.1 21.5,42.1 25.3,38.3 ETH_R4.2 | 24.7,33.3 ETH_C11.1 26.15,34.45 26.4,34.7 ETH_R6.2
  Top 0.305: U$1.9 23.35,10.8 | ETH_C2.1 ETH_C1.1 23.25,7.35 23.7,6.9 ETH_C0.+ 25.2,7.4 32,7.4 34.6,7.4 35.8,8.6 35.8,11.8 v35.8,14 ETH_L0.1 30.05,18.05 ETH_C5.+ 29.55,18.55 ETH_C3.1 ETH_C4.1 25.2,18.55 24.85,18.2 U$1.19 | U$1.1 21.7,16.38 21.7,18.2 21.35,18.55 ETH_C7.1 ETH_C6.1 19.15,18.5 ETH_C8.+ 15.3,18.5 14.8,19 14.8,29.3 15.9,30.4 23.4,30.4 24.2,31.2 24.2,33.8 | 24.2,33.8 24.2,35.7 23.3,36.6 18.2,36.6 17.34,37.47 U$2.5 15.95,39.8 14.68,39.8 U$2.2 | 24.2,33.8 24.7,33.3
  Bottom 0.203: 17.34,35.6 18.23,36.5 v25.7,36.5
  Bottom 0.305: v35.8,14 33.9,14 33.1,13.2 33.1,6.2 31.6,4.7 19.2,4.7 17.34,6.57 17.34,35.6 U$2.5
ETH_VDDCR
  Top 0.203: U$1.6 20.35,13.85 19.75,13.25 ETH_C10.1 ETH_C9.1
ETH_XTAL1
  Top 0.203: U$5.1 10.01,13.75 10.01,14.01 10.35,14.35 13.05,14.35 | U$1.5 13.05,14.35 | ETH_C13.1 12.6,13.9 13.05,14.35
ETH_XTAL2
  Top 0.203: U$1.4 13.06,14.84 | ETH_C14.1 12.6,15.3 13.06,14.84 | 13.06,14.84 8.56,14.84 8.4,15 U$5.3
GND  (via drill 0.5 pad 1)
  other vias: 97,34.2 98.6,35 98.6,33.4 97,32.6 98.6,31.8 97,31 98.6,30.2 97,29.4 98.6,28.6 97,27.8 98.6,27 98.6,25.4 97,26.2 95.4,27 95.4,25.4 97,35.8 98.6,36.6 97,37.4 98.6,38.2 97,39 98.6,39.8 97,40.6 95.4,39.8 95.4,38.2 95.4,36.6 95.4,35 95.4,33.4 95.4,31.8 95.4,30.2 95.4,28.6 95.4,41.4 97,42.2 98.6,41.4 95.4,43 98.6,43 97,43.8 97,45.4 97,47 98.6,46.2 98.6,44.6 95.4,44.6 95.4,46.2 95.4,47.8 97,48.6 95.4,49.4 97,50.2 95.4,51 98.6,49.4 98.6,47.8 10.3,17.4 11.4,18.4 11.4,16.3 9.2,18.4 8.1,17.4 7,18.4 7,16.3 5.9,17.4 5.5,15.5 7,14.8 5.5,14 7,13.3 5.9,12.2 7,11.1 8.1,12.2 9.2,11.1 10.3,12.3 11.4,13.3 11.4,11.1 41,42.1 42.6,42.1 41.8,41 53,42.1 54.6,42.1 53.8,41 41,21.9 42.6,21.9 41.8,20.8 53,21.9 54.6,21.9 53.8,20.8 41,11.5 42.6,11.5 41.8,10.4 53,11.5 54.6,11.5 53.8,10.4 81,40 82.6,40 81.8,38.9 73.5,40 75.1,40 74.3,38.9 27.4,14 19.2,26.8 20.8,26.8 20,25.7 23.9,55.8 23.1,54.2 22.3,55.8 21.5,54.2 20.7,55.8 19.9,54.2 19.1,55.8 18.3,54.2 16.7,54.2 17.5,55.8 15.9,55.8 15.1,54.2 13.5,54.2 11.9,54.2 12.7,55.8 14.3,55.8 10.3,54.2 9.5,55.8 11.1,55.8 87,38.2 88.6,38.2 87.8,37.1
  pour Bottom: 30.5,57.5 30,58 0.5,58 0,57.5 0,0.5 0.5,0 100.5,0 101,0.5 101,57.5 100.5,58 80.5,58 80,57.5 80,50.5 79.5,50 70.5,50 70,49.5 70,39 69.5,38.5 66.5,38.5 66,39 66,55.5 65.5,56 35,56 34.5,55.5 34.5,50.5 34,50 31,50 30.5,50.5
  pour Top: 30.5,57.5 30,58 0.5,58 0,57.5 0,0.5 0.5,0 100.5,0 101,0.5 101,57.5 100.5,58 85.5,58 85,57.5 85,48.5 84.5,48 79.5,48 77.5,50 72.5,50 72,49.5 72,39 71.5,38.5 66,38.5 65.5,39 65.5,55.5 65,56 35,56 34.5,55.5 34.5,45 31.5,42 8.5,42 6.5,40 4.5,40 4,40.5 4,46 4.5,46.5 30,46.5 30.5,47
N$1
  Top 0.203: U$1.24 22.35,20.85 21.6,21.6 ETH_R0.1
N$2
  Top 0.203: U$1.7 22.35,12.72 22.15,12.53 21.02,12.53 20.1,11.6 20.1,5.54 21.75,3.89 25.99,3.89 27,4.9 ETH_R10.2
N$3
  Top 0.203: U$1.8 22.85,12.65 22.3,12.1 21.2,12.1 20.46,11.36 20.46,5.68 21.89,4.25 25.85,4.25 27.9,6.3 ETH_R11.2
N$4
  Top 0.203: U$1.10 23.85,11.64 26.99,8.5 ETH_R13.1
N$5
  Top 0.203: J1.10 53.75,49.55 53.3,49.1 ESP_R4.1
N$6
  Top 0.203: U$2.10 13.78,16.93 15.35,15.35 U$1.3
N$7
  Top 0.203: ESP_R3.2 67.4,32.49 T2.1
N$8
  Top 0.203: ESP_R2.2 71.22,33.99 T1.1
N$10
  Top 0.203: U$1.11 24.35,12.05 26.5,9.9 ETH_R12.2
N$17
  Top 0.203: ETH_R1.2 10.7,33.05 U$2.9
N$19
  Top 0.203: ETH_R2.2 20.1,32.91 19.62,33.38 U$2.11
P$1  (via drill 0.5 pad 1)
  other vias: 68,40 78,52
  pour Top: 5.5,41 5,41.5 5,45 5.5,45.5 31,45.5 31.5,46 31.5,57.5 32,58 83.5,58 84,57.5 84,49.5 83.5,49 80,49 78,51 71.5,51 71,50.5 71,40 70.5,39.5 67,39.5 66.5,40 66.5,56.5 66,57 34,57 33.5,56.5 33.5,45.5 31,43 7,43 6.5,42.5 6.5,41.5 6,41
  pour Bottom: 33,51 32,51 31.5,51.5 31.5,57.5 32,58 78.5,58 79,57.5 79,51.5 78.5,51 69.5,51 69,50.5 69,40 68.5,39.5 67.5,39.5 67,40 67,56.5 66.5,57 34,57 33.5,56.5 33.5,51.5
SAM4E_INT  (via drill 0.5 pad 1)
  Top 0.203: ESP_IC.24 75.5,6.17 v75.5,8.1 | J2.6 90.2,47 v90.8,46.4
  Bottom 0.203: v90.8,46.4 90.8,11.5 88.7,9.4 76.8,9.4 v75.5,8.1